# EAGLE design Exposure Timer Button Panel (EAGLE 6.4)
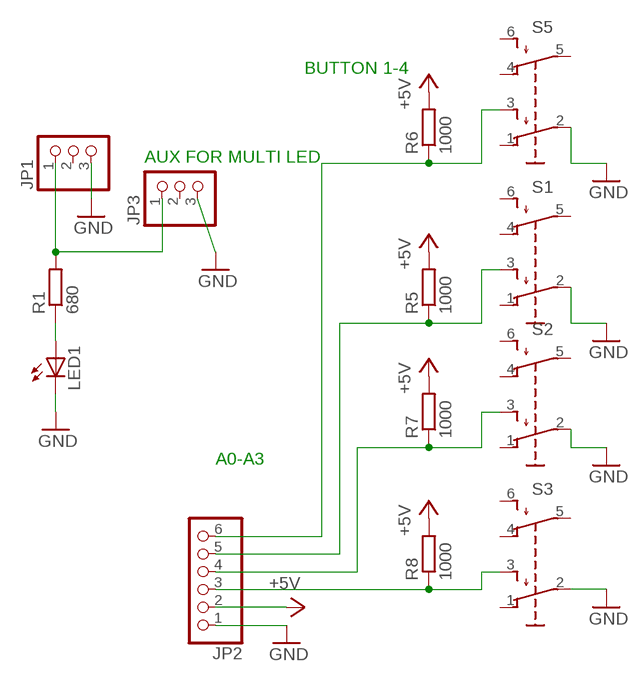
[diagram p0: schematic, sheet 1]

## Parts
JP1  PINHD-1X3  [1X03]
JP2  PINHD-1X6  [1X06]
JP3  PINHD-1X3  [1X03]
LED1  LED5MM  [LED5MM]
R1  680  R-EU_0204/7  [0204/7]
R5  1000  R-EU_0204/7  [0204/7]
R6  1000  R-EU_0204/7  [0204/7]
R7  1000  R-EU_0204/7  [0204/7]
R8  1000  R-EU_0204/7  [0204/7]
S1  TL42PO  [TL4XPO]
S2  TL42PO  [TL4XPO]
S3  TL42PO  [TL4XPO]
S5  TL42PO  [TL4XPO]

## Nets
+5V: JP2.2 R5.2 R6.2 R7.2 R8.2
GND: JP1.3 JP2.1 JP3.3 LED1.K(C) S1.2(P) S2.2(P) S3.2(P) S5.2(P)
N$3: JP1.1 JP3.1 R1.2
N$4: LED1.A R1.1
N$17: JP2.6 R6.1 S5.3(S)
N$18: JP2.5 R5.1 S1.3(S)
N$19: JP2.4 R7.1 S2.3(S)
N$20: JP2.3 R8.1 S3.3(S)
Unconnected: JP1.2 JP3.2 S1.1(O) S1.4(O1) S1.5(P1) S1.6(S1) S2.1(O) S2.4(O1) S2.5(P1) S2.6(S1) S3.1(O) S3.4(O1) S3.5(P1) S3.6(S1) S5.1(O) S5.4(O1) S5.5(P1) S5.6(S1)

## Notes on the sheet
- BUTTON 1-4
- AUX FOR MULTI LED
- A0-A3

## Library data of the parts
JP1 JP3 = adafruit:PINHD-1X3: PIN HEADER
JP2 = adafruit:PINHD-1X6: PIN HEADER
LED1 = adafruit:LED: LED OSRAM: - CHIPLED LG R971, LG N971, LY N971, LG Q971, LY Q971, LO R971, LY R971 LH N974, LH R974 LS Q976, LO Q976, LY Q976 LO Q996 - Hyper CHIPLED LW Q18S LB Q993, LB Q99A, LB R99A - SideLED LS A670, LO A670, LY A670, LG A670, LP A670 LB A673, LV A673, LT A673, LW A673 LH A674 LY A675 LS A676, LA A676, LO A676, LY A676, LW A676 LS A679, LY A679, LG A679 - Hyper Micro SIDELED® LS Y876, LA Y876, LO Y876, LY Y876 LT Y87S - SmartLED LW L88C, LW L88S LB L89C, LB L89S, LG L890 LS L89K, LO L89K, LY L89K LS L896, LA L896, LO L896, LY L896 - TOPLED LS T670, LO T670, LY T670, LG T670, LP T670 LSG T670, LSP T670, LSY T670, LOP T670, LYG T670 LG T671, LOG T671, LSG T671 LB T673, LV T673, LT T673, LW T673 LH T674 LS T676, LA T676, LO T676, LY T676, LB T676, LH T676, LSB T676, LW T676 LB T67C, LV T67C, LT T67C, LS T67K, LO T67K, LY T67K, LW E67C LS E67B, LA E67B, LO E67B, LY E67B, LB E67C, LV E67C, LT E67C LW T67C LS T679, LY T679, LG T679 LS T770, LO T770, LY T770, LG T770, LP T770 LB T773, LV T773, LT T773, LW T773 LH T774 LS E675, LA E675, LY E675, LS T675 LS T776, LA T776, LO T776, LY T776, LB T776 LHGB T686 LT T68C, LB T68C - Hyper Mini TOPLED® LB M676 - Mini TOPLED Santana® LG M470 LS M47K, LO M47K, LY M47K Source: http://www.osram.convergy.de/
R1 R5-R8 = resistor:R-EU_: RESISTOR, European symbol
S1-S3 S5 = switch:TL42PO: TINY SWITCH ON - MOM Source: http://www2.produktinfo.conrad.com/datenblaetter/700000-724999/705152-da-01-de-Subminiaturschalter_TL_36YO.pdf

## Net classes
0 default: width 0.813 mm, drill 0.61 mm, clearance 0.813 mm

## Board
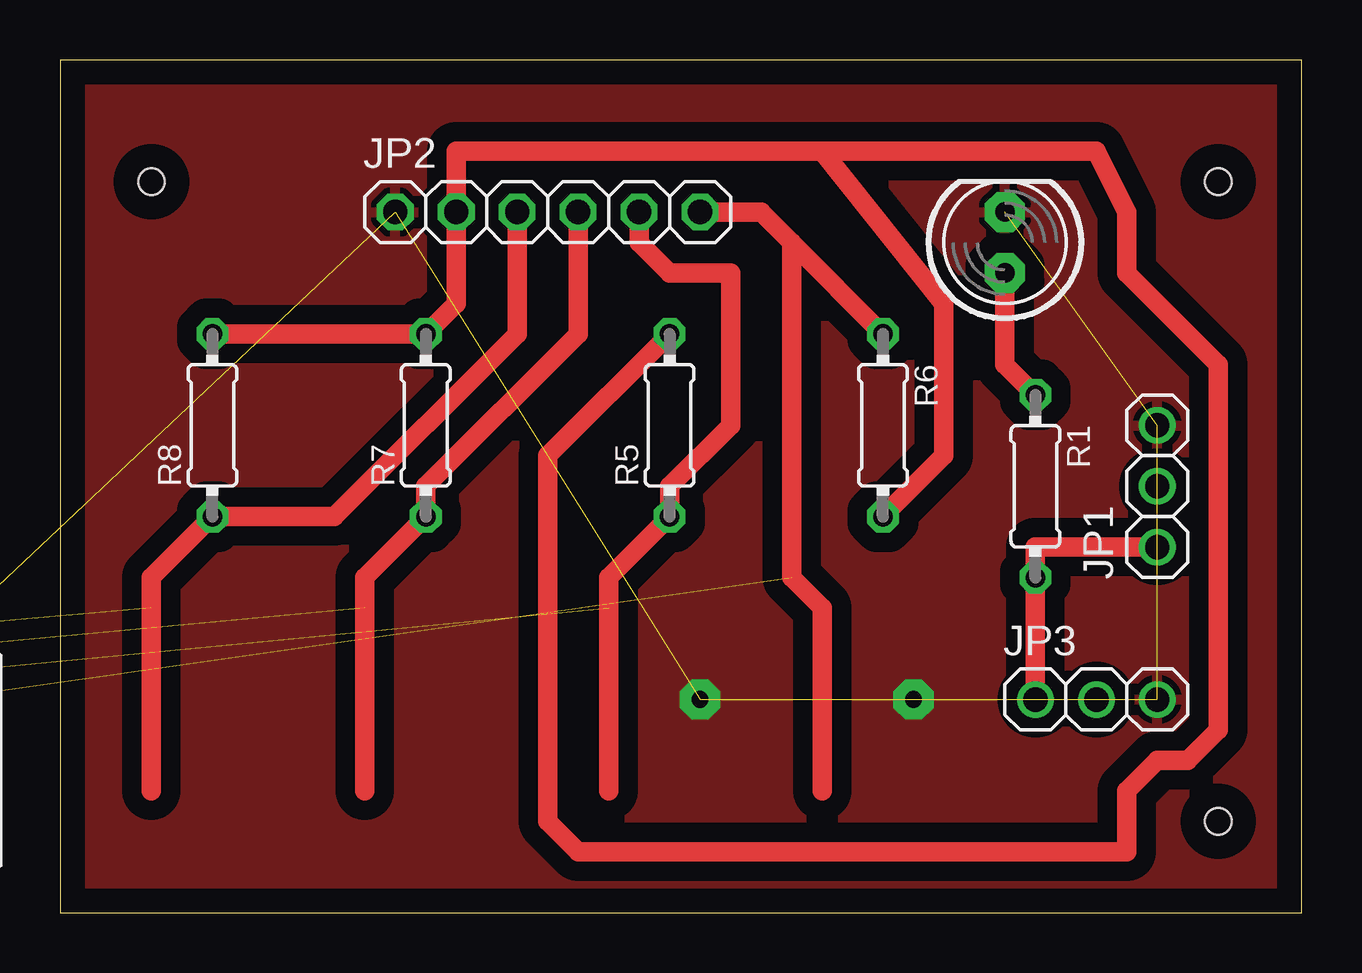
[diagram p1: board, top side]

Size 51.74 x 35.55 mm. Coordinates in mm from the lower left corner, seen from the top.
Outline: 0,0 51.74,0 51.74,35.55 0,35.55 0,0
Copper layers (1*16): Top 0.035mm / dielectric 1.5mm / Bottom 0.035mm
Design rules "default": minimum track width 10mil, minimum drill 24mil, track to track 8mil, track to pad 8mil, pad to pad 8mil, via to via 8mil, smd to smd 8mil, copper to edge 40mil, drill to drill 8mil, minimum pad ring 10mil, minimum via ring 8mil, stop-mask expansion 4mil, vias tented up to drill 0mil, thermal gap 10mil
Holes 1.1 mm at 3.81,30.48 48.26,3.81 48.26,30.48

### Footprints (pad centres in the part's own frame; a part is rotated, then mirrored left to right if it is on the bottom)
1X03 = drill 1.016: 1 -2.54,0; 2 0,0; 3 2.54,0
1X06 = drill 1.016 octagon: 1 -6.35,0; 2 -3.81,0; 3 -1.27,0; 4 1.27,0; 5 3.81,0; 6 6.35,0
LED5MM = drill 0.813 pad 1.676 octagon: A -1.27,0; K 1.27,0
0204/7 = drill 0.813 octagon: 1 -3.81,0; 2 3.81,0
TL4XPO = drill 1.1 pad 1.676: 1 -2.54,2.54; 2 0,2.54; 3 2.54,2.54; 4 -2.54,-2.54; 5 0,-2.54; 6 2.54,-2.54

### Placement (x,y rotation side)
JP1  45.72,17.78 90 top
JP2  20.32,29.21 0 top
JP3  43.18,8.89 0 top
LED1  39.37,27.94 90 top
R1  40.64,17.78 270 top
R5  25.4,20.32 90 top
R6  34.29,20.32 270 top
R7  15.24,20.32 90 top
R8  6.35,20.32 90 top
S1  -19.05,6.35 0 top  (outside the outline)
S2  -30.48,6.35 0 top  (outside the outline)
S3  -41.91,6.35 0 top  (outside the outline)
S5  -7.62,6.35 0 top  (outside the outline)

### Tracks (layer width: path | path; a pad name or v marks a point on that pad's centre or on a via)
+5V
  Top 0.813: R8.2 R7.2 16.51,25.4 JP2.2 16.51,31.75 31.75,31.75 | R6.2 36.83,19.05 36.83,25.4 31.75,31.75 | R5.2 20.32,19.05 20.32,3.81 21.59,2.54 44.45,2.54 44.45,5.08 45.72,6.35 46.99,6.35 48.26,7.62 48.26,22.86 44.45,26.67 44.45,29.21 43.18,31.75 31.75,31.75
GND  (via drill 0.7 pad 1.68)  (9 unrouted)
  other vias: 26.67,8.89 35.56,8.89
  pour Top: -1.27,35.56 52.07,35.56 52.07,-1.27 -1.27,-1.27
N$3
  Top 0.813: JP3.1 R1.2 40.64,15.24 JP1.1
N$4
  Top 0.813: R1.1 39.37,22.86 LED1.A
N$17  (1 unrouted)
  Top 0.813: 31.75,5.08 31.75,12.7 30.48,13.97 30.48,27.94 | 30.48,27.94 29.21,29.21 JP2.6 | 30.48,27.94 R6.1
N$18  (1 unrouted)
  Top 0.813: 22.86,5.08 22.86,12.7 22.86,13.97 R5.1 25.4,17.78 27.94,20.32 27.94,26.67 25.4,26.67 24.13,27.94 JP2.5
N$19  (1 unrouted)
  Top 0.813: 12.7,5.08 12.7,12.7 12.7,13.97 R7.1 15.24,17.78 21.59,24.13 JP2.4
N$20  (1 unrouted)
  Top 0.813: 3.81,5.08 3.81,12.7 3.81,13.97 R8.1 11.43,16.51 19.05,24.13 JP2.3